# Altium project SuperKnob.PrjPcb
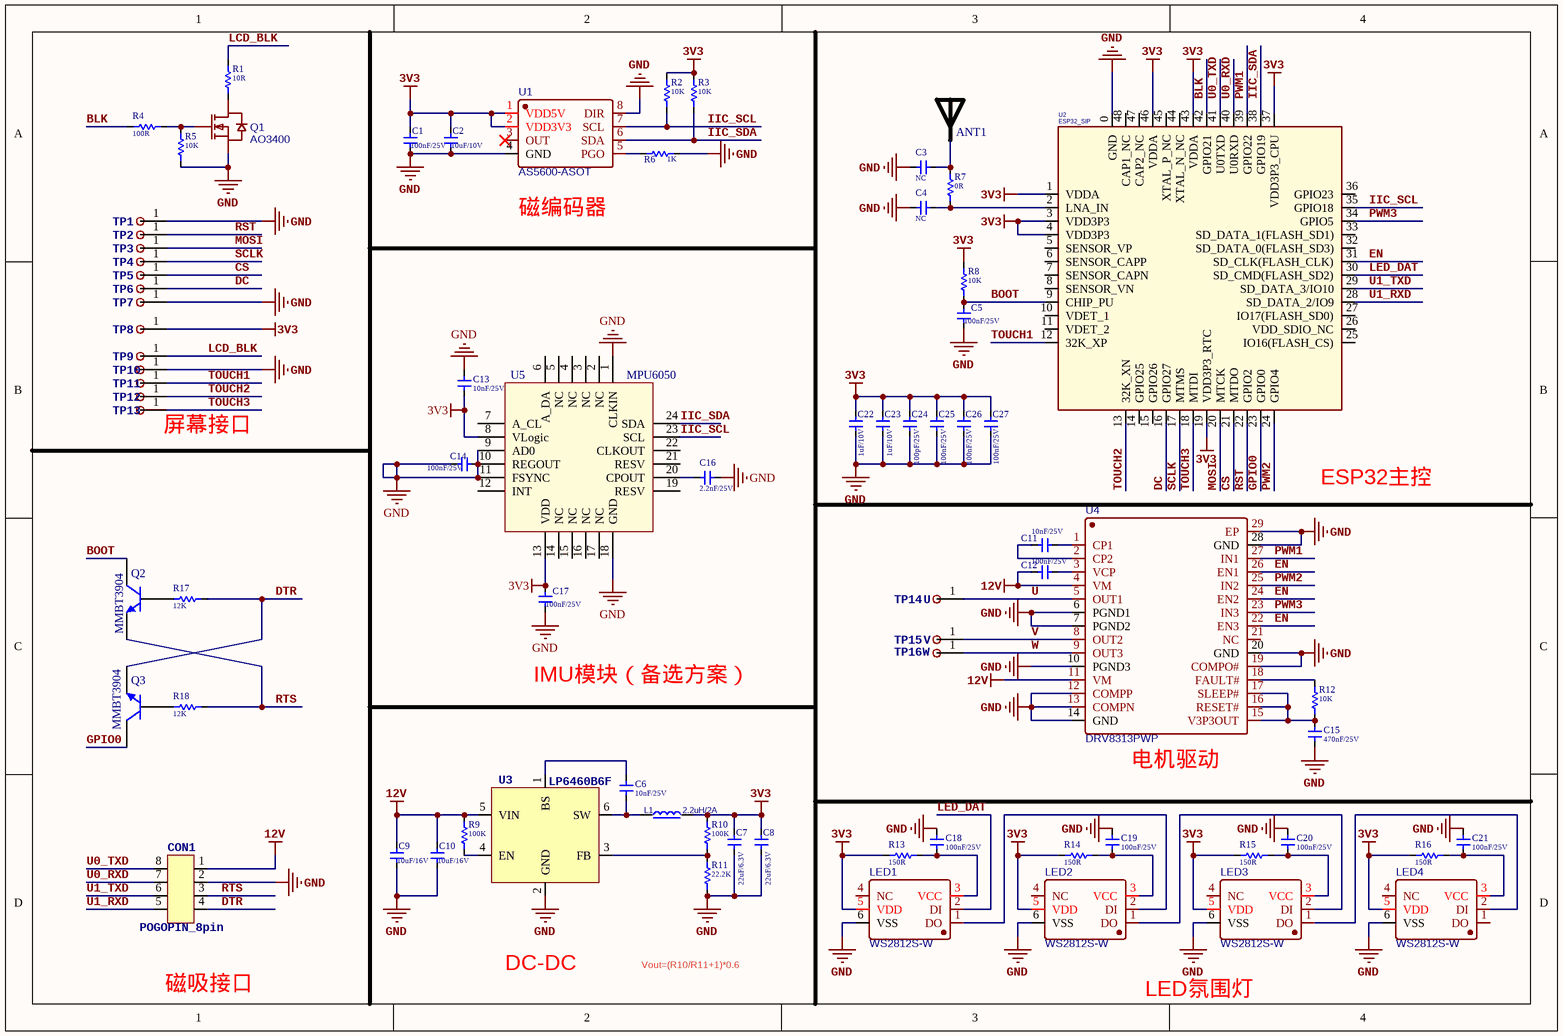
[diagram p0: SuperKnob.SchDoc]
1 sheet, 76 parts. Net scope: global (net labels, ports and power ports of the same name join across sheets).
Board files: SuperKnob.PcbDoc, PCB1.PcbDoc

## Sheet SuperKnob.SchDoc
size A4

### Parts
ANT1  RAINSUN  [ANT-Rainsun-AN5120]  (value not drawn)
C1  100nF/25V  [CAPC_0402]
C2  10uF/10V  [CAPC_0402]
C3  NC  [CAPC_0402]
C4  NC  [CAPC_0402]
C5  100nF/25V  [CAPC_0402]
C6  10nF/25V  [CAPC_0402]
C7  22uF/6.3V  [CAPC_0805]
C8  22uF/6.3V  [CAPC_0805]
C9  10uF/16V  [CAPC_0805]
C10  10uF/16V  [CAPC_0805]
C11  10nF/25V  [CAPC_0402]
C12  100nF/25V  [CAPC_0402]
C13  10nF/25V  [CAPC_0402]
C14  100nF/25V  [CAPC_0402]
C15  470nF/25V  [CAPC_0402]
C16  2.2nF/25V  [CAPC_0402]
C17  100nF/25V  [CAPC_0402]
C18  100nF/25V  [CAPC_0402]
C19  100nF/25V  [CAPC_0402]
C20  100nF/25V  [CAPC_0402]
C21  100nF/25V  [CAPC_0402]
C22  1uF/10V  [CAPC_0402]
C23  1uF/10V  [CAPC_0402]
C24  100pF/25V  [CAPC_0402]
C25  100nF/25V  [CAPC_0402]
C26  100nF/25V  [CAPC_0402]
C27  100nF/25V  [CAPC_0402]
CON1  POGOPIN_8pin  [POGOPIN_8pin]
L1  2.2uH/2A  [Inductor_CD_43]
LED1  WS2812S-W  [LED-SMD_6P-L5.0-W5.0-TL]
LED2  WS2812S-W  [LED-SMD_6P-L5.0-W5.0-TL]
LED3  WS2812S-W  [LED-SMD_6P-L5.0-W5.0-TL]
LED4  WS2812S-W  [LED-SMD_6P-L5.0-W5.0-TL]
Q1  AO3400  [SOT23_3]
Q2  MMBT3904  [SOT23_3]
Q3  MMBT3904  [SOT23_3]
R1  10R  [RESC_0402]
R2  10K  [RESC_0402]
R3  10K  [RESC_0402]
R4  100R  [RESC_0402]
R5  10K  [RESC_0402]
R6  1K  [RESC_0402]
R7  0R  [RESC_0402]
R8  10K  [RESC_0402]
R9  100K  [RESC_0402]
R10  100K  [RESC_0402]
R11  22.2K  [RESC_0402]
R12  10K  [RESC_0402]
R13  150R  [RESC_0603]
R14  150R  [RESC_0603]
R15  150R  [RESC_0603]
R16  150R  [RESC_0603]
R17  12K  [RESC_0402]
R18  12K  [RESC_0402]
TP1  TP  [TP]  (value not drawn)
TP2  TP  [TP]  (value not drawn)
TP3  TP  [TP]  (value not drawn)
TP4  TP  [TP]  (value not drawn)
TP5  TP  [TP]  (value not drawn)
TP6  TP  [TP]  (value not drawn)
TP7  TP  [TP]  (value not drawn)
TP8  TP  [TP]  (value not drawn)
TP9  TP  [TP]  (value not drawn)
TP10  TP  [TP]  (value not drawn)
TP11  TP  [TP]  (value not drawn)
TP12  TP  [TP]  (value not drawn)
TP13  TP  [TP]  (value not drawn)
TP14  U  [TP]
TP15  V  [TP]
TP16  W  [TP]
U1  AS5600-ASOT  [SOIC_8]
U2  ESP32_SIP  [QFN-48_7X7]
U3  LP6460B6F  [SOT23_6]
U4  DRV8313PWP  [TSSOP_28]
U5  MPU6050  [QFN-24]

### Nets
3V3: C1.2 C2.2 C7.2 C8.2 C13.2 C17.2 C22.2 C23.2 C24.1 C25.2 C26.2 C27.2 L1.1 LED1.5(VDD) LED2.5(VDD) LED3.5(VDD) LED4.5(VDD) R2.2 R3.2 R8.1 R10.1 R13.1 R14.1 R15.1 R16.1 TP8.1 U1.1(VDD5V) U1.2(VDD3V3) U2.1(VDDA) U2.3(VDD3P3) U2.4(VDD3P3) U2.19(VDD3P3_RTC) U2.37(VDD3P3_CPU) U2.43(VDDA) U2.46(VDDA) U5.8(VLogic) U5.13(VDD)
12V: C9.2 C10.2 C12.1 CON1.1 R9.1 U3.5(VIN) U4.4(VM) U4.11(VM)
GND: C1.1 C2.1 C3.1 C4.1 C5.1 C7.1 C8.1 C9.1 C10.1 C13.1 C14.1 C14.2 C15.1 C16.2 C17.1 C18.2 C19.2 C20.1 C21.1 C22.1 C23.1 C24.2 C25.1 C26.1 C27.1 CON1.2 LED1.6(VSS) LED2.6(VSS) LED3.6(VSS) LED4.6(VSS) Q1.2(S) R5.2 R6.2 R11.2 TP1.1 TP7.1 TP10.1 U1.4(GND) U1.8(DIR) U2.0(GND) U3.2(GND) U4.6(PGND1) U4.7(PGND2) U4.10(PGND3) U4.12(COMPP) U4.13(COMPN) U4.14(GND) U4.19(COMPO#) U4.20(GND) U4.28(GND) U4.29(EP) U5.1(CLKIN) U5.9(AD0) U5.10(REGOUT) U5.11(FSYNC) U5.18(GND)
BLK: R4.1 U2.42(GPIO21)
BOOT: C5.2 Q2.3(C) R8.2 U2.9(CHIP_PU)
CS: TP5.1 U2.21(MTDO)
DC: TP6.1 U2.16(GPIO27)
DTR: CON1.4 Q3.2(E) R17.2
EN: U2.31(SD_CLK(FLASH_CLK)) U4.22(EN3) U4.24(EN2) U4.26(EN1)
GPIO0: Q3.3(C) U2.23(GPIO0)
IIC_SCL: R2.1 U1.7(SCL) U2.35(GPIO18) U5.23(SCL)
IIC_SDA: R3.1 U1.6(SDA) U2.38(GPIO19) U5.24(SDA)
LCD_BLK: R1.2 TP9.1
LED_DAT: LED1.2(DI) U2.30(SD_CMD(FLASH_SD2))
MOSI: TP3.1 U2.20(MTCK)
PWM1: U2.39(GPIO22) U4.27(IN1)
PWM2: U2.24(GPIO4) U4.25(IN2)
PWM3: U2.34(GPIO5) U4.23(IN3)
RST: TP2.1 U2.22(GPIO2)
RTS: CON1.3 Q2.2(E) R18.2
SCLK: TP4.1 U2.17(MTMS)
TOUCH1: TP11.1 U2.12(32K_XP)
TOUCH2: TP12.1 U2.13(32K_XN)
TOUCH3: TP13.1 U2.18(MTDI)
U: TP14.1 U4.5(OUT1)
U0_RXD: CON1.7 U2.40(U0RXD)
U0_TXD: CON1.8 U2.41(U0TXD)
U1_RXD: CON1.5 U2.28(SD_DATA_2/IO9)
U1_TXD: CON1.6 U2.29(SD_DATA_3/IO10)
V: TP15.1 U4.8(OUT2)
W: TP16.1 U4.9(OUT3)
NetANT1_1: ANT1.1 C3.2 R7.1
NetC4_2: C4.2 R7.2 U2.2(LNA_IN)
NetC6_1: C6.1 L1.2 U3.6(SW)
NetC6_2: C6.2 U3.1(BS)
NetC11_1: C11.1 U4.2(CP2)
NetC11_2: C11.2 U4.1(CP1)
NetC12_2: C12.2 U4.3(VCP)
NetC15_2: C15.2 R12.2 U4.15(V3P3OUT) U4.16(RESET#) U4.17(SLEEP#)
NetC16_1: C16.1 U5.20(CPOUT)
NetC18_1: C18.1 LED1.3(VCC) R13.2
NetC19_1: C19.1 LED2.3(VCC) R14.2
NetC20_2: C20.2 LED3.3(VCC) R15.2
NetC21_2: C21.2 LED4.3(VCC) R16.2
NetLED1_1: LED1.1(DO) LED2.2(DI)
NetLED2_1: LED2.1(DO) LED3.2(DI)
NetLED3_1: LED3.1(DO) LED4.2(DI)
NetQ1_1: Q1.1(G) R4.2 R5.1
NetQ1_3: Q1.3(D) R1.1
NetQ2_1: Q2.1(B) R17.1
NetQ3_1: Q3.1(B) R18.1
NetR6_1: R6.1 U1.5(PGO)
NetR9_2: R9.2 U3.4(EN)
NetR10_2: R10.2 R11.1 U3.3(FB)
NetR12_1: R12.1 U4.18(FAULT#)

Not connected (* = marked no-connect by the designer): LED1 4(NC); LED2 4(NC); LED3 4(NC); LED4 1(DO) 4(NC); U1 3(OUT)*; U2 5(SENSOR_VP) 6(SENSOR_CAPP) 7(SENSOR_CAPN) 8(SENSOR_VN) 10(VDET_1) 11(VDET_2) 14(GPIO25) 15(GPIO26) 25(IO16(FLASH_CS)) 26(VDD_SDIO_NC) 27(IO17(FLASH_SD0)) 32(SD_DATA_0(FLASH_SD3)) 33(SD_DATA_1(FLASH_SD1)) 36(GPIO23) 44(XTAL_N_NC) 45(XTAL_P_NC) 47(CAP2_NC) 48(CAP1_NC); U4 21(NC); U5 2(NC) 3(NC) 4(NC) 5(NC) 6(A_DA) 7(A_CL) 12(INT) 14(NC) 15(NC) 16(NC) 17(NC) 19(RESV) 21(RESV) 22(CLKOUT)

### Notes on the sheet
- (near U1) 磁编码器
- 屏幕接口
- ESP32主控
- IMU模块（备选方案）
- (near U4) 电机驱动
- DC-DC
- Vout=(R10/R11+1)*0.6
- 磁吸接口
- LED氛围灯

### Library data of the parts
ANT1 = ANT-Rainsun-AP5120: 贴片天线
C1-C27 = 电容-0402: 贴片电容; Value: 0.1u
CON1 = POGOPIN_8pin: 磁吸连接器
L1 = PL4020: 贴片电感; Material name: 功率电感; Value: WPN4020H2R2MT; PCB DECAL: PL4020
LED1-LED4 = WS2812S-W: BOM_Manufacturer: Worldsemi; Contributor: LCSC; BOM_Supplier: LCSC; BOM_Manufacturer Part: WS2812S-W; BOM_Supplier Part: C114584; BOM_JLCPCB Part Class: Extended Part; spicePre: L; spiceSymbolName: WS2812S-W
Q1 = FH3400C: BOM_Manufacturer: 鑫飞宏; Contributor: LCSC; BOM_Supplier: LCSC; BOM_Supplier Part: C2940037; BOM_Manufacturer Part: FH3400C; BOM_JLCPCB Part Class: Extended Part; spicePre: Q; spiceSymbolName: FH3400C
Q2 Q3 = SMT_TRIODE_NPN: Surface mount NPN transistor, package SOT-23
R1-R18 = 电阻-0402: 贴片电阻; Value: 22R
TP1-TP16 = TP: 测试点
U1 = AS5600-ASOT: 磁编码器; BOM_Manufacturer: Advanced Monolithic Systems; Contributor: LCSC; BOM_Supplier: LCSC; BOM_Supplier Part: C499458; BOM_Manufacturer Part: AS5600-ASOT; BOM_JLCPCB Part Class: Extended Part; spicePre: U; spiceSymbolName: AS5600-ASOT
U2 = ESP32-PICO: 主控芯片
U3 = LP6460B6F: DC-DC芯片
U4 = DRV8313PWP: 驱动芯片; BOM_Manufacturer: TI(德州仪器); Contributor: LCSC; BOM_Supplier: LCSC; BOM_Supplier Part: C2863441; BOM_Manufacturer Part: DRV8313PWP; spicePre: U; spiceSymbolName: DRV8313PWP
U5 = MPU6050: 六轴传感器